# EAGLE design toggleswitch_pump (EAGLE 7.2.0)
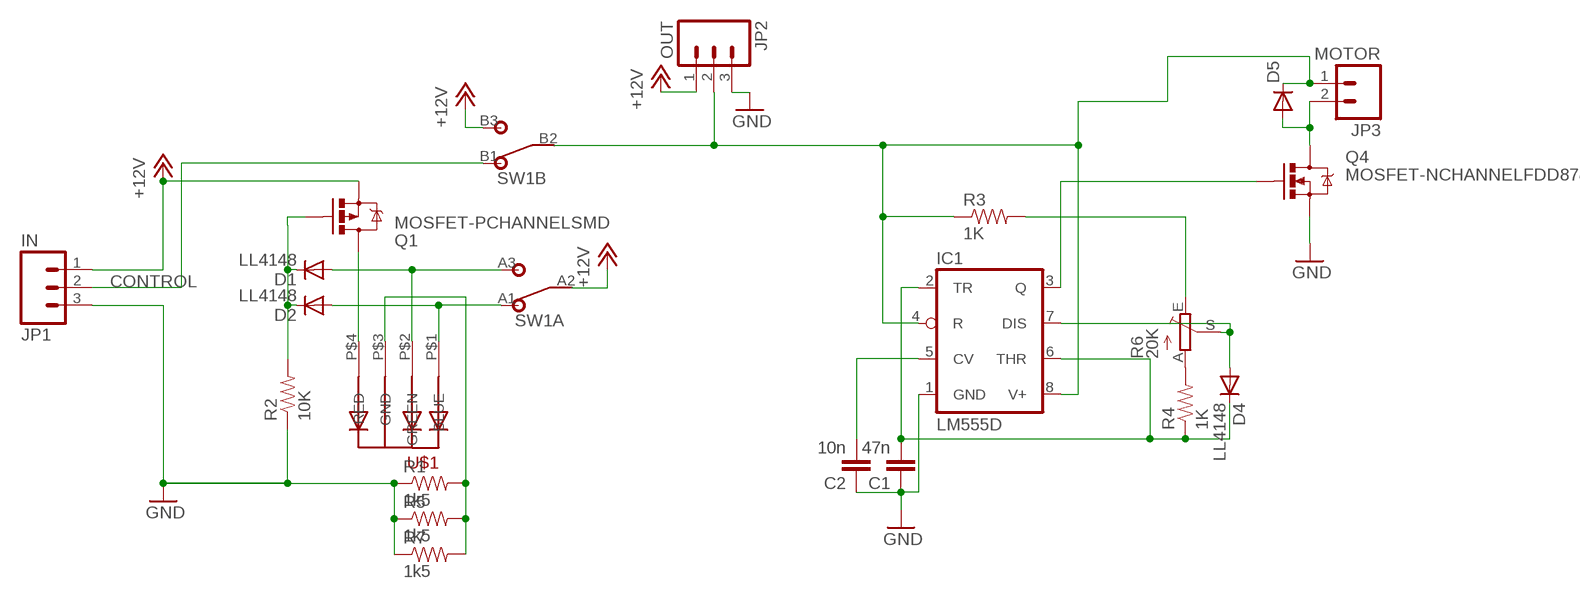
[diagram p0: schematic, sheet 1]

## Parts
C1  47n  CAP0603-CAP  [0603-CAP]
C2  10n  CAP0603-CAP  [0603-CAP]
D1  LL4148  DIODE-MINIMELF  [MINIMELF]
D2  LL4148  DIODE-MINIMELF  [MINIMELF]
D4  LL4148  DIODE-MINIMELF  [MINIMELF]
D5  DIODESMB  [SMB-DIODE]
IC1  LM555D  [SO08]
JP1  IN  M03POLAR_LOCK  [MOLEX-1X3_LOCK]
JP2  OUT  M03POLAR_LOCK  [MOLEX-1X3_LOCK]
JP3  MOTOR  M02POLAR_LOCK  [MOLEX-1X2_LOCK]
Q1  MOSFET-PCHANNELSMD  [SOT23-3]
Q4  MOSFET-NCHANNELFDD8780  [DPAK]
R1  1k5  RESISTOR0603-RES  [0603-RES]
R2  10K  RESISTOR0603-RES  [0603-RES]
R3  1K  RESISTOR0603-RES  [0603-RES]
R4  1K  RESISTOR0603-RES  [0603-RES]
R5  1k5  RESISTOR0603-RES  [0603-RES]
R6  20K  TRIM_EU-RJ9W  [RJ9W]
R7  1k5  RESISTOR0603-RES  [0603-RES]
SW1  DPDT  [DPDT]
U$1  5MMRGBLED  [LED5MMRGB]

## Nets
+12V: JP1.1 JP2.1 Q1.2(S) SW1.A2 SW1.B3
CONTROL: JP1.2 SW1.B1
GND: C1.1 C2.1 IC1.1(GND) JP1.3 JP2.3 Q4.3(S) R1.1 R2.1 R5.1 R7.1
N$1: R1.2 R5.2 R7.2 U$1.P$3(GND)
N$2: Q1.3(D) U$1.P$4(RED)
N$3: D1.C D2.C Q1.1(G) R2.2
N$4: D1.A SW1.A3 U$1.P$2(GREEN)
N$5: D2.A SW1.A1 U$1.P$1(BLUE)
N$6: R3.2 R6.E
N$8: D4.A IC1.7(DIS) R6.S
N$9: C1.2 D4.C IC1.2(TR) IC1.6(THR) R4.1
N$10: IC1.3(Q) Q4.1(G)
N$11: C2.2 IC1.5(CV)
N$13: D5.A JP3.2 Q4.4(D)
N$14: R4.2 R6.A
OUT1: D5.C IC1.4(R) IC1.8(V+) JP2.2 JP3.1 R3.1 SW1.B2

## Library data of the parts
C1 C2 = SparkFun:CAP: Capacitor Standard 0603 ceramic capacitor, and 0.1" leaded capacitor.
D1 D2 D4 = diode:DIODE-: DIODE
D5 = SparkFun:DIODE: Diode These are standard reverse protection diodes and small signal diodes. SMA package can handle up to about 1A. SOD-323 can handle about 200mA. What the SOD-323 package when ordering, there are some mfgs out there that are 5-pin packages.
IC1 = adafruit:*555: TIMER Changed DIP package to have round (not oval) pin pads http://www.ladyada.net/library/pcb/eaglelibrary.html
JP1 JP2 = SparkFun:M03: Header 3 Standard 3-pin 0.1" header. Use with straight break away headers (SKU : PRT-00116), right angle break away headers (PRT-00553), swiss pins (PRT-00743), machine pins (PRT-00117), and female headers (PRT-00115). Molex polarized connector foot print use with SKU : PRT-08232 with associated crimp pins and housings.
JP3 = SparkFun:M02: Header 2 Standard 2-pin 0.1" header. Use with straight break away headers (SKU : PRT-00116), right angle break away headers (PRT-00553), swiss pins (PRT-00743), machine pins (PRT-00117), and female headers (PRT-00115). Molex polarized connector foot print use with SKU : PRT-08233 with associated crimp pins and housings.
Q1 = SparkFun-DiscreteSemi:MOSFET-PCHANNEL: Generic PMOSFET
Q4 = SparkFun-DiscreteSemi:MOSFET-NCHANNEL: Common NMOSFET Parts MFG P/N Store ID Prod ID FDD8780 TRANS-09984 SI7820DN TRANS-11055 FDS6630A IC-08089 2N7002PW TRANS-11151 FQP30N06L COM-10213 TRANS-10060 BSS123LT1G TRANS-08345 BSS138 TRANS-00830 BS170 2N7000; PROD_ID: TRANS-09984
R1-R5 R7 = SparkFun:RESISTOR: Resistor Basic schematic elements and footprints for 0603, 1206, and PTH 1/10th watt (small) resistors.
R6 = pot:TRIM_EU-: POTENTIOMETER
SW1 = switches:DPDT
U$1 = led_rgb:5MMRGBLED

## Board
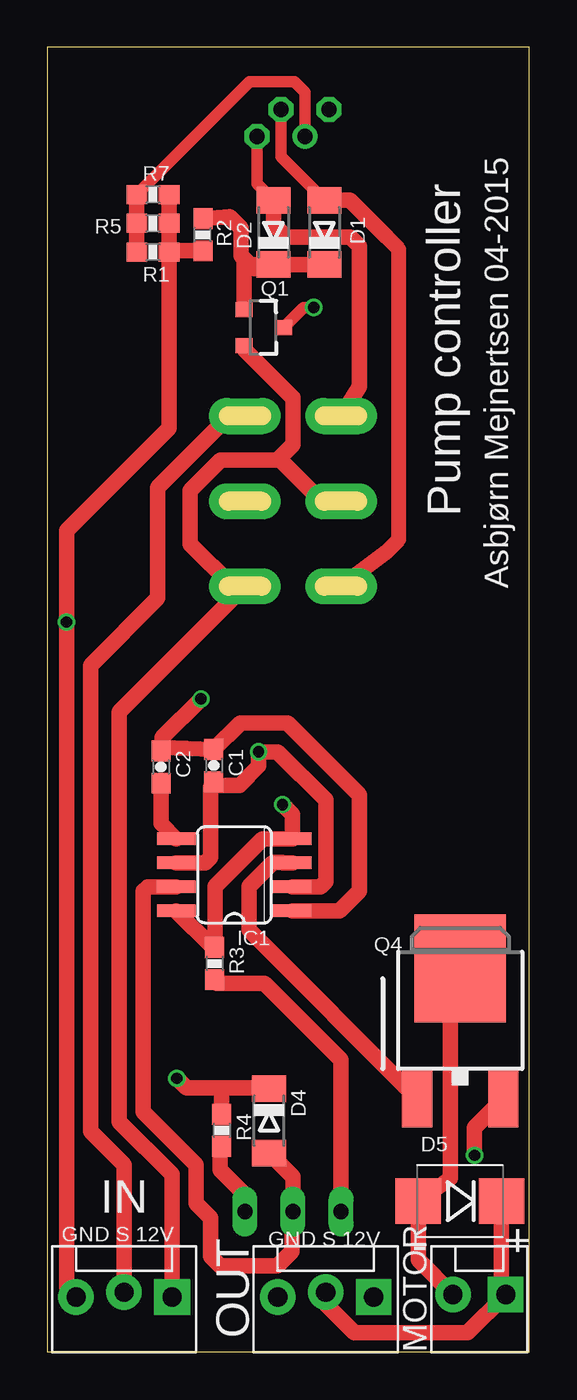
[diagram p1: board, top side]
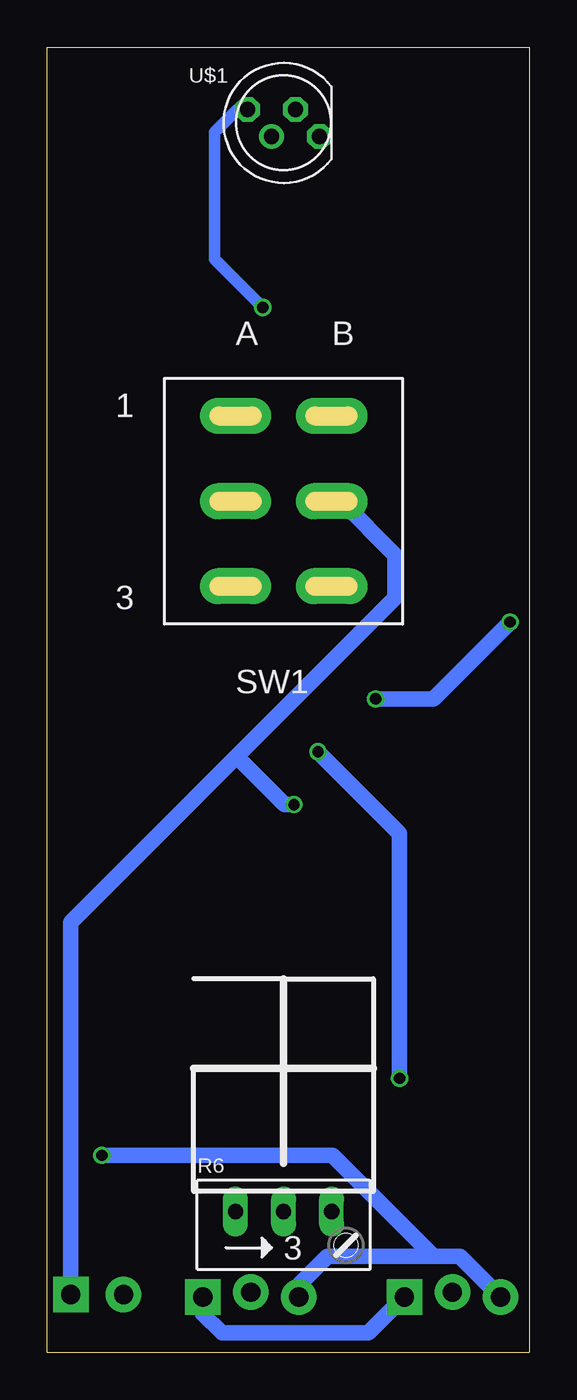
[diagram p2: board, bottom side, seen from below]

Size 25.5 x 69 mm. Coordinates in mm from the lower left corner, seen from the top.
Outline: 25.5,0 25.5,69 0,69 0,0 25.5,0
Copper layers (1*16): Top 0.035mm / dielectric 1.5mm / Bottom 0.035mm
Design rules "SeeedStudio_2layer_DRU_no_angle_20140221": minimum track width 6mil, minimum drill 12mil, track to track 6mil, track to pad 6mil, pad to pad 6mil, via to via 6mil, smd to smd 0mil, copper to edge 10mil, drill to drill 10mil, minimum pad ring 10mil, minimum via ring 6mil, stop-mask expansion 2mil, vias tented up to drill 100mil, thermal gap 10mil

### Footprints (pad centres in the part's own frame; a part is rotated, then mirrored left to right if it is on the bottom)
0603-CAP = smd 1.1 x 1: 1 -0.85,0; 2 0.85,0
MINIMELF = smd 1.4 x 1.8: A 1.7,0; C -1.7,0
SMB-DIODE = smd 2.4 x 2.4: A 2.2,0; C -2.2,0
SO08 = smd 0.66 x 2.032: 1 -1.905,-3.073; 2 -0.635,-3.073; 3 0.635,-3.073; 4 1.905,-3.073; 5 1.905,3.073; 6 0.635,3.073; 7 -0.635,3.073; 8 -1.905,3.073
MOLEX-1X3_LOCK = drill 1.016 pad 1.88 square: 1 0,0.127 | drill 1.016 pad 1.88: 2 2.54,-0.127; 3 5.08,0.127
MOLEX-1X2_LOCK = drill 1.016 pad 1.88 square: 1 -0.127,0 | drill 1.016 pad 1.88: 2 2.667,0
SOT23-3 = smd 0.8 x 0.9: 1 -0.95,-1; 2 0.95,-1; 3 0,1.1
DPAK = smd 1.6 x 3: 1 -2.28,-5.31; 3 2.28,-5.31 | smd 4.826 x 5.715: 4 0,1.588
0603-RES = smd 1.1 x 1: 1 -0.85,0; 2 0.85,0
RJ9W = drill 0.813 long: A 2.54,0.635; E -2.54,0.635; S 0,0.635
DPDT = drill 0.8 pad 1.9 long: A1 -2.54,4.5; A2 -2.54,0; A3 -2.54,-4.5; B1 2.54,4.5; B2 2.54,0; B3 2.54,-4.5
LED5MMRGB = drill 0.8 pad 0.813 octagon: P$1 -1.905,0.714; P$2 -0.635,-0.714; P$4 1.905,-0.714 | drill 0.8 pad 0.813: P$3 0.635,0.714

### Placement (x,y rotation side)
C1  8.81,31.01 270 top
C2  6.01,30.94 270 top
D1  14.66,59.21 90 top
D2  11.97,59.21 90 top
D4  11.73,12.24 270 top
D5  21.83,7.98 180 top
IC1  9.9,25.24 90 top
JP1  6.6,3.05 180 top
JP2  17.27,3.05 180 top
JP3  24.13,3.05 180 top
Q1  11.4,54.18 270 top
Q4  21.84,18.7 0 top
R1  5.59,58.17 180 top
R2  8.23,59.08 90 top
R3  8.85,20.55 270 top
R4  9.23,11.73 270 top
R5  5.59,59.69 180 top
R6  13,6.8 0 bottom
R7  5.59,61.21 180 top
SW1  13,45 0 bottom
U$1  13,65 180 bottom

### Tracks (layer width: path | path; a pad name or v marks a point on that pad's centre or on a via)
+12V
  Top 0.813: JP1.1 6.6,9.4 3.81,12.19 3.81,33.85 SW1.B3 9.8,40.5 7.57,42.73 7.57,45.57 9.17,47.17 12.17,47.17 12.26,47.26 | 12.26,47.26 13,48 13,50.47 12.98,50.47 10.4,53.05 Q1.2 | SW1.A2 14.51,45 12.26,47.26
  Bottom 0.813: JP1.1 8.51,1.02 16.26,1.02 17.27,2.03 JP2.1
CONTROL
  Top 0.813: JP1.2 4.06,9.91 2.29,11.68 2.29,36.32 5.84,39.88 5.84,45.72 9.78,49.66 9.78,49.5 SW1.B1
GND  (via drill 0.6)
  Top 0.813: C2.1 6.09,31.96 | 6.09,31.96 C1.1 10.22,33.27 12.7,33.27 16.51,29.46 16.51,24.38 15.46,23.34 IC1.1 | R1.1 R5.1 R7.1 | R1.1 6.5,58.23 R2.1 | 24.38,13.13 Q4.3 22.61,11.87 v22.61,10.41 | R1.1 6.44,48.86 1.02,43.43 1.02,40.13 v1.02,38.61 1.02,3.43 JP1.3 | 6.09,31.96 6.09,32.5 v8.13,34.54
  Bottom 0.813: JP1.3 3.68,5.08 5.08,5.08 | 5.08,5.08 10.67,5.08 12.19,3.56 JP2.3 | v22.61,10.41 10.41,10.41 5.08,5.08 | v8.13,34.54 5.08,34.54 v1.02,38.61
N$1
  Top 0.61: R7.2 10.71,67.18 13.08,67.18 13.63,66.63 U$1.P$3
  Top 0.813: R1.2 R5.2 R7.2
N$2  (via drill 0.6)
  Top 0.61: Q1.3 13.57,55.24 v14.1,55.24
  Bottom 0.61: v14.1,55.24 16.64,57.78 16.64,64.52 15.44,65.71 U$1.P$4
N$3
  Top 0.813: D1.C D2.C 10.72,57.51 | R2.2 9.64,60.03 10.24,59.44 10.24,57.99 10.44,57.79 | 10.44,57.79 10.72,57.51 | 10.94,57.3 10.72,57.51 | Q1.1 10.4,57.75 10.44,57.79
N$4
  Top 0.61: D1.A 12.37,63.2 U$1.P$2
  Top 0.8: 17.96,42.34 18.6,42.98 18.6,58.32 17.96,58.96
  Top 0.813: 17.96,58.96 16.01,60.91 D1.A | 17.96,42.34 SW1.A3
N$5
  Top 0.61: D2.A 11.1,61.78 U$1.P$1
  Top 0.813: D2.A 11.97,59.64 12.65,58.96 16.03,58.96 16.51,58.47 16.51,51.05 SW1.A1
N$6
  Top 0.813: R6.E 15.54,15.46 11.5,19.5 8.95,19.5 R3.2
N$8
  Top 0.813: D4.A 13,9.27 R6.S 12.95,7.39 12.95,5.33 12.19,4.57 9.14,4.57 8.64,5.08 8.64,7.11 7.87,7.87 7.87,9.91 5.08,12.7 5.08,24.38 5.3,24.61 IC1.7
N$9  (via drill 0.6)
  Top 0.813: IC1.6 8.35,25.88 8.64,26.16 8.64,29.89 C1.2 8.9,29.97 10.16,29.97 11.18,30.99 v11.18,31.75 12.19,31.75 14.73,29.21 14.73,24.89 14.45,24.61 IC1.2 | D4.C 11.7,13.97 9.14,13.97 | 9.14,13.97 7.37,13.97 v6.86,14.48 | R4.1 9.23,13.88 9.14,13.97
  Bottom 0.813: v6.86,14.48 6.86,27.43 v11.18,31.75
N$10
  Top 0.813: IC1.3 12.48,25.88 12.45,25.91 11.94,25.91 10.67,24.64 10.67,22.33 19.56,13.43 Q4.1
N$11
  Top 0.813: IC1.5 6.01,27.96 C2.2
N$13
  Top 0.813: JP3.2 19.63,4.88 D5.A 21.34,9.18 21.34,19.56 21.84,20.07 Q4.4
N$14
  Top 0.813: R6.A 10.5,7.43 10.5,8.3 9.14,9.65 9.14,10.69 R4.2
OUT1  (via drill 0.6)
  Top 0.813: JP2.2 14.73,2.54 16.26,1.02 22.23,1.02 JP3.1 24.03,3.28 D5.C | IC1.8 8.76,21.4 R3.1 8.89,21.44 8.89,24.64 11.4,27.14 IC1.4 12.97,28.43 v12.45,28.96
  Bottom 0.813: SW1.B2 9.95,45 7.11,42.16 7.11,39.88 15.49,31.5 | 15.49,31.5 24.26,22.73 JP3.1 | v12.45,28.96 12.95,28.96 15.49,31.5

### Text on the board
tNames: Pump controller | Asbjørn Mejnertsen 04-2015 | IN | GND S 12V | GND S 12V | - | + | OUT | MOTOR